# EAGLE design sol_sens (EAGLE 6.3)
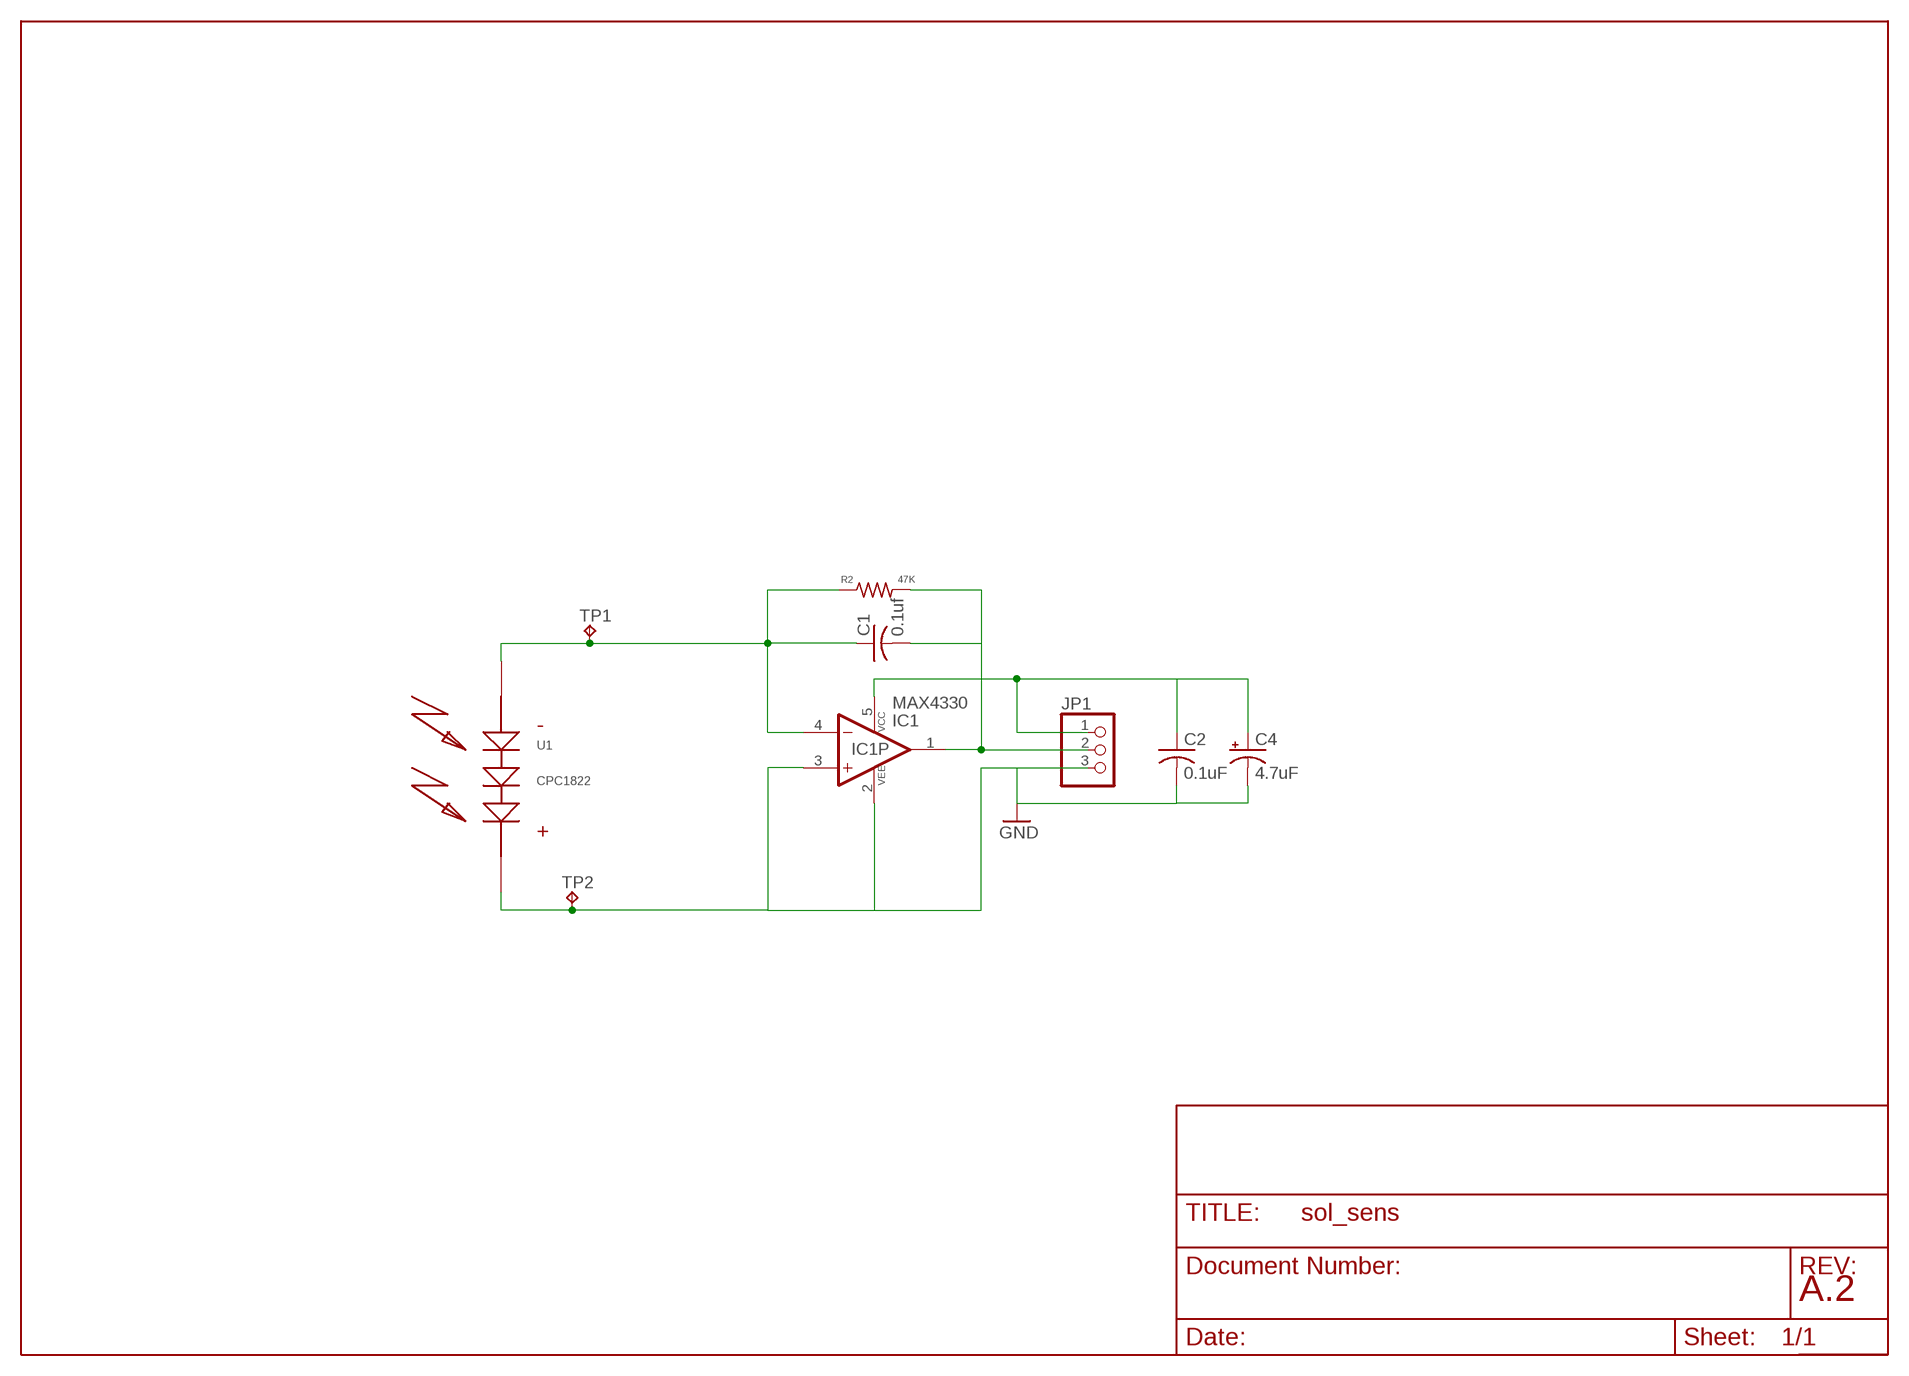
[diagram p0: schematic, sheet 1]

## Parts
C1  0.1uf  C-USC0805  [C0805]
C2  0.1uF  C-USC0805  [C0805]
C4  4.7uF  CPOL-USR/2012-12R  [R/2012-12R]
IC1  MAX4330  [SOT23-5]
JP1  PINHD-1X3  [1X03]
R2  47K  R-US_R0805  [R0805]
TP1  TPB1,27  [B1,27]
TP2  TPB1,27  [B1,27]
U1  CPC1822  [SO08]

## Nets
GND: C2.2 C4.- IC1.2(VEE) IC1.3(+IN) JP1.3 TP2.PP(TP) U1.8(V+)
N$1: C1.1 IC1.4(-IN) R2.1 TP1.PP(TP) U1.5(V-)
N$2: C1.2 IC1.1(OUT) JP1.2 R2.2
N$3: C2.1 C4.+ IC1.5(VCC) JP1.1

## Notes on the sheet
- A.2

## Library data of the parts
C1 C2 = rcl:C-US: CAPACITOR, American symbol
C4 = rcl:CPOL-US: POLARIZED CAPACITOR, American symbol
IC1 = Stofer:MAX4330: OP AMP
JP1 = wifi_WX:PINHD-1X3: PIN HEADER
R2 = rcl:R-US_: RESISTOR, American symbol
TP1 TP2 = Stofer:TP
U1 = Stofer:CPC1822: Micro Solar Cell

## Board
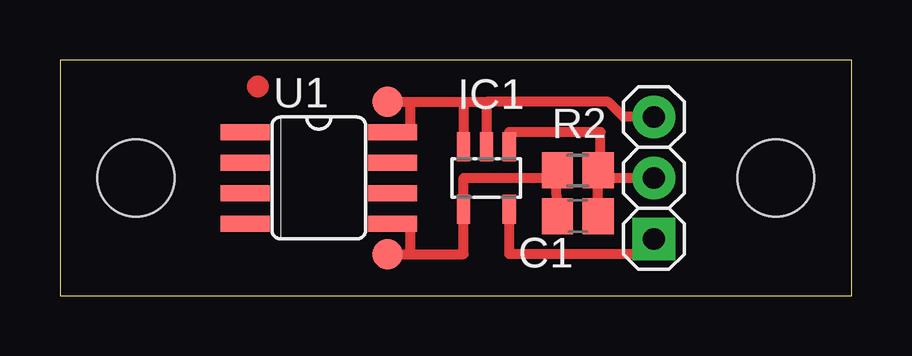
[diagram p1: board, top side]
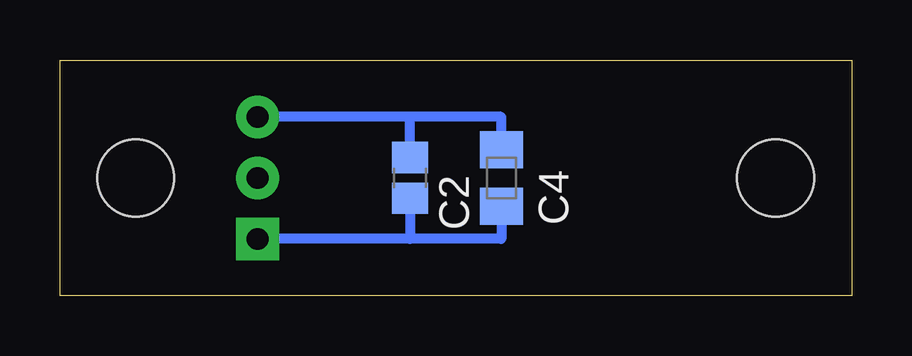
[diagram p2: board, bottom side, seen from below]

Size 33 x 9.83 mm. Coordinates in mm from the lower left corner, seen from the top.
Outline: 0,0 33,0 33,9.83 0,9.83 0,0
Copper layers (1*16): Top 0.035mm / dielectric 1.5mm / Bottom 0.035mm
Design rules "sparkfun": minimum track width 8mil, minimum drill 20mil, track to track 8mil, track to pad 8mil, pad to pad 8mil, via to via 8mil, smd to smd 8mil, copper to edge 10mil, drill to drill 8mil, minimum pad ring 12mil, minimum via ring 10mil, stop-mask expansion 4mil, vias tented up to drill 25mil, thermal gap 10mil
Holes 3.2 mm at 3.17,4.92 29.84,4.92

### Footprints (pad centres in the part's own frame; a part is rotated, then mirrored left to right if it is on the bottom)
C0805 = smd 1.3 x 1.5: 1 -0.85,0; 2 0.85,0
R/2012-12R = smd 1.55 x 1.8: + 1.175,0; - -1.175,0
SOT23-5 = smd 0.55 x 1.2: 1 -0.95,-1.3; 2 0,-1.3; 3 0.95,-1.3; 4 0.95,1.3; 5 -0.95,1.3
1X03 = drill 0.9 pad 1.778 square: 1 -2.54,0 | drill 0.9 pad 1.778: 2 0,0; 3 2.54,0
R0805 = smd 1.3 x 1.5: 1 -0.85,0; 2 0.85,0
B1,27 = smd 1.27 x 1.27: PP 0,0
SO08 = smd 0.66 x 2.032: 1 -1.905,-3.073; 2 -0.635,-3.073; 3 0.635,-3.073; 4 1.905,-3.073; 5 1.905,3.073; 6 0.635,3.073; 7 -0.635,3.073; 8 -1.905,3.073

### Placement (x,y rotation side)
C1  21.59,3.33 0 top
C2  18.41,4.92 90 bottom
C4  14.6,4.92 270 bottom
IC1  17.77,4.92 180 top
JP1  24.76,4.92 90 top
R2  21.59,5.23 0 top
TP1  13.65,1.74 0 top
TP2  13.65,8.09 0 top
U1  10.79,4.92 270 top

### Tracks (layer width: path | path; a pad name or v marks a point on that pad's centre or on a via)
GND
  Top 0.406: 16.82,8.09 IC1.3 | 14.6,8.09 16.82,8.09 | 16.82,8.09 17.77,8.09 | 17.77,6.18 IC1.2 17.77,8.09 | 14.6,8.09 14.6,6.82 U1.8 | TP2.PP 14.6,8.09 | JP1.3 23.49,7.46 22.86,8.09 17.77,8.09
  Bottom 0.406: C4.- 14.6,7.46 18.41,7.46 | 18.41,7.46 JP1.3 | C2.2 18.41,7.46
N$1
  Top 0.406: 14.6,1.74 14.6,3.01 U1.5 | 14.6,1.74 16.82,1.74 IC1.4 16.82,4.92 20.95,4.92 20.73,5.13 R2.1 20.63,5.23 20.73,3.23 20.95,3.01 C1.1 | TP1.PP 14.6,1.74
N$2
  Top 0.406: IC1.1 18.72,6.82 22.54,6.82 22.54,4.92 | 22.54,4.92 R2.2 22.22,4.92 | C1.2 22.43,4.7 22.22,4.92 | 22.22,4.92 22.54,4.92 | 22.54,4.92 JP1.2
N$3
  Top 0.406: IC1.5 18.73,1.74 24.76,1.74 JP1.1
  Bottom 0.406: C4.+ 14.6,2.38 18.41,2.38 | 18.41,2.38 JP1.1 | C2.1 18.41,2.38
(copper drawn outside any net)
  shapes: Top circle x1

### Text on the board
bDocu: GND | OUT | +5V